# EAGLE design curtain (EAGLE 9.4.0)
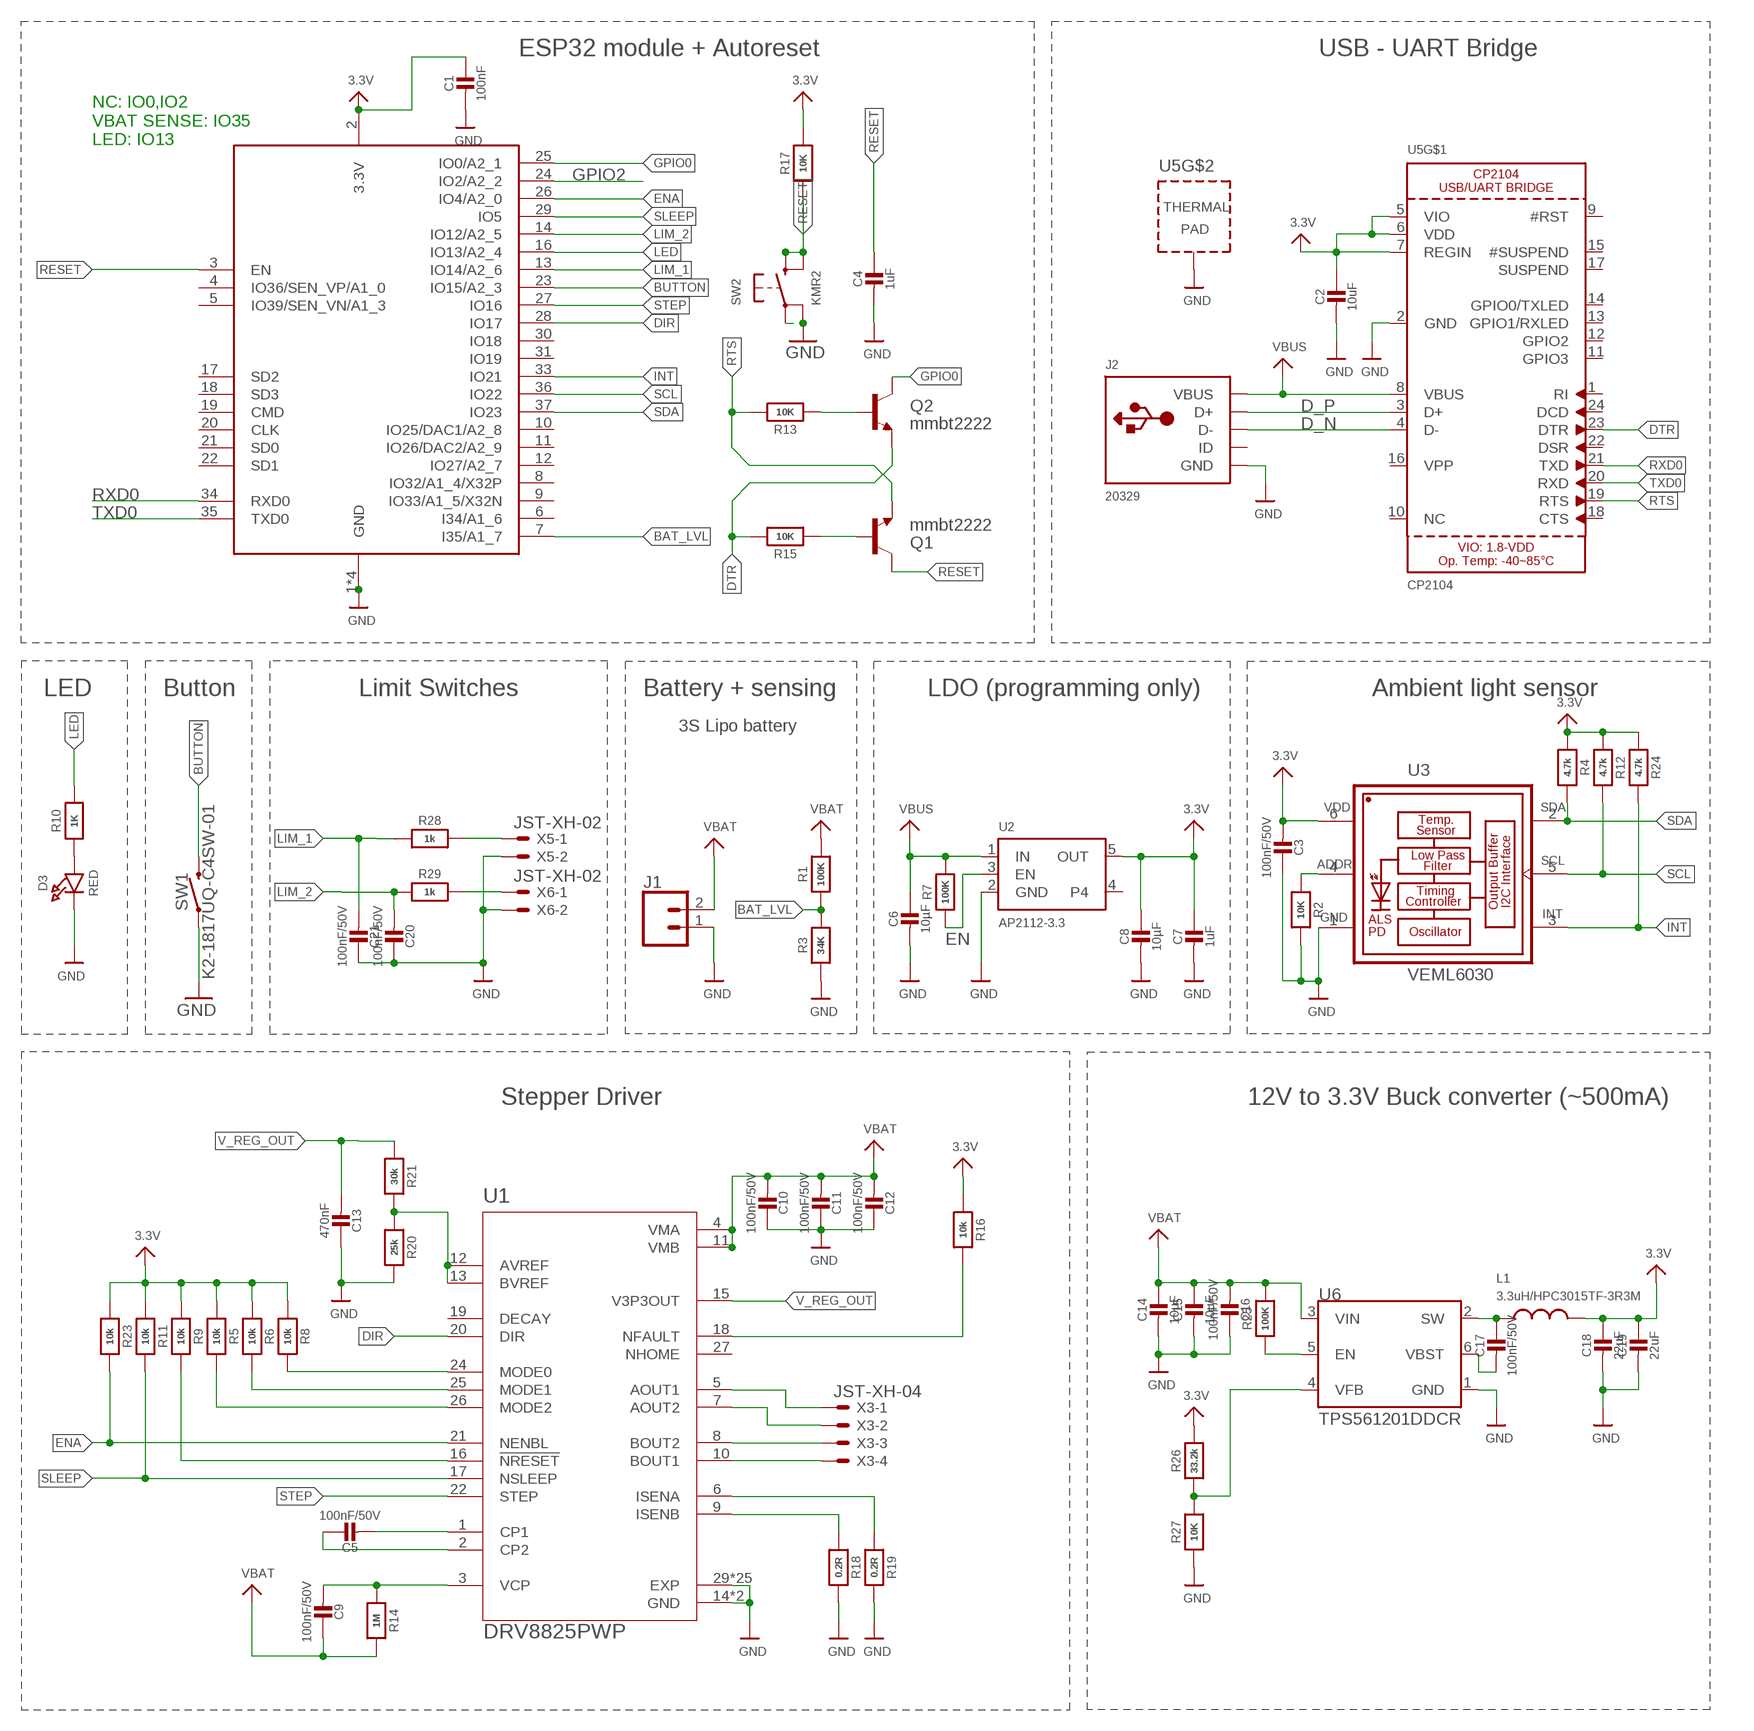
[diagram p0: schematic, sheet 1]

## Parts
C1  100nF  CAP_CERAMIC_0402  [_0402]
C2  10uF  CAP_CERAMIC_0402  [_0402]
C3  100nF/50V  CAP_CERAMIC_0402  [_0402]
C4  1uF  CAP_CERAMIC_0402  [_0402]
C5  100nF/50V  CAP_CERAMIC_0805  [_0805]
C6  10µF  CAP_CERAMIC_0402  [_0402]
C7  1uF  CAP_CERAMIC_0402  [_0402]
C8  10µF  CAP_CERAMIC_0402  [_0402]
C9  100nF/50V  CAP_CERAMIC_0805  [_0805]
C10  100nF/50V  CAP_CERAMIC_0805  [_0805]
C11  100nF/50V  CAP_CERAMIC_0805  [_0805]
C12  100nF/50V  CAP_CERAMIC_0805  [_0805]
C13  470nF  CAP_CERAMIC_0402  [_0402]
C14  10µF  CAP_CERAMIC_0402  [_0402]
C15  10µF  CAP_CERAMIC_0402  [_0402]
C16  100nF/50V  CAP_CERAMIC_0402  [_0402]
C17  100nF/50V  CAP_CERAMIC_0402  [_0402]
C18  22uF  CAP_CERAMIC_0402  [_0402]
C19  22uF  CAP_CERAMIC_0402  [_0402]
C20  100nF/50V  CAP_CERAMIC_0402  [_0402]
C21  100nF/50V  CAP_CERAMIC_0402  [_0402]
D3  RED  LED0805_NOOUTLINE  [CHIPLED_0805_NOOUTLINE]
J1  CONN_023.5MM_LOCK  [SCREWTERMINAL-3.5MM-2_LOCK]
J2  20329  USB_MICRO_20329_V2  [4UCONN_20329_V2]
L1  3.3uH/HPC3015TF-3R3M  WPN4020H100MT  [WPN4020H100MT]
Q1  mmbt2222  TRANSISTOR_NPNSOT23-3  [SOT23-3]
Q2  mmbt2222  TRANSISTOR_NPNSOT23-3  [SOT23-3]
R1  100K  RESISTOR_0402  [_0402]
R2  10K  RESISTOR_0402  [_0402]
R3  34K  RESISTOR_0402  [_0402]
R4  4.7k  RESISTOR_0402  [_0402]
R5  10k  RESISTOR_0402  [_0402]
R6  10k  RESISTOR_0402  [_0402]
R7  100K  RESISTOR_0402  [_0402]
R8  10k  RESISTOR_0402  [_0402]
R9  10k  RESISTOR_0402  [_0402]
R10  1K  RESISTOR_0402  [_0402]
R11  10k  RESISTOR_0402  [_0402]
R12  4.7k  RESISTOR_0402  [_0402]
R13  10K  RESISTOR_0402  [_0402]
R14  1M  RESISTOR_0402  [_0402]
R15  10K  RESISTOR_0402  [_0402]
R16  10k  RESISTOR_0402  [_0402]
R17  10K  RESISTOR_0402  [_0402]
R18  0.2R  RESISTOR_1206  [_1206]
R19  0.2R  RESISTOR_1206  [_1206]
R20  25k  RESISTOR_0402  [_0402]
R21  30k  RESISTOR_0402  [_0402]
R23  10k  RESISTOR_0402  [_0402]
R24  4.7k  RESISTOR_0402  [_0402]
R25  100K  RESISTOR_0402  [_0402]
R26  33.2k  RESISTOR_0402  [_0402]
R27  10K  RESISTOR_0402  [_0402]
R28  1k  RESISTOR_0402  [_0402]
R29  1k  RESISTOR_0402  [_0402]
SW1  K2-1817UQ-C4SW-01  [K2-1817UQ-C4SW-01]
SW2  KMR2  SWITCH_TACT_SMT4.6X2.8  [BTN_KMR2_4.6X2.8]
U1  DRV8825PWP  [SOP65P640X120-29N]
U2  AP2112-3.3  VREG_SOT23-5  [SOT23-5]
U3  VEML6030  [VISHAY_VEML6030_2X2X0.87]
U4  ESP32_WROOM32_SKINNY  [WROOM32_SKINNY]
U5  CP2104  [QFN24_4MM_SMSC]
U6  TPS561201DDCR  [SOT95P280X110-6N]
X3  JST-XH-04  JST-XH-04-PIN-ROUND-PAD  [JST-XH-04-PACKAGE-ROUND-PAD]
X5  JST-XH-02  JST-XH-02-PIN-ROUND-PAD  [JST-XH-02-PACKAGE-ROUND-PAD]
X6  JST-XH-02  JST-XH-02-PIN-ROUND-PAD  [JST-XH-02-PACKAGE-ROUND-PAD]

## Nets
3.3V: C1.1 C2.1 C3.2 C7.1 C8.1 C18.1 C19.1 L1.2 R4.1 R5.1 R6.1 R8.1 R9.1 R11.1 R12.1 R16.1 R17.2 R23.1 R24.1 R26.1 U2.5(OUT) U3.6(VDD) U4.2(3.3V) U5.5(VIO) U5.6(VDD) U5.7(REGIN)
BAT_LVL: R1.1 R3.2 U4.7(I35/A1_7)
BUTTON: SW1.P$2 U4.23(IO15/A2_3)
D_N: J2.D- U5.4(D-)
D_P: J2.D+ U5.3(D+)
DIR: U1.20(DIR) U4.28(IO17)
DTR: Q2.2(E) R15.2 U5.23(DTR)
EN: R7.1 U2.3(EN)
ENA: R23.2 U1.21(NENBL) U4.26(IO4/A2_0)
GND: C1.2 C2.2 C3.1 C4.2 C6.2 C7.2 C8.2 C10.1 C11.1 C12.1 C13.1 C14.2 C15.2 C16.1 C18.2 C19.2 C20.1 C21.1 D3.C J1.1 J2.BASE@1(GND) J2.BASE@2(GND) J2.GND J2.SPRT@1(GND) J2.SPRT@2(GND) J2.SPRT@3(GND) J2.SPRT@4(GND) R2.2 R3.1 R18.2 R19.2 R20.2 R27.1 SW1.P$1 SW2.A'(P1) U1.14(GND) U1.28(GND) U1.29(EXP) U1.P1(EXP) U1.P2(EXP) U1.P3(EXP) U1.P4(EXP) U1.P5(EXP) U1.P6(EXP) U1.P7(EXP) U1.P8(EXP) U1.P9(EXP) U1.P10(EXP) U1.P11(EXP) U1.P12(EXP) U1.P13(EXP) U1.P14(EXP) U1.P15(EXP) U1.P16(EXP) U1.P17(EXP) U1.P18(EXP) U1.P19(EXP) U1.P20(EXP) U1.P21(EXP) U1.P22(EXP) U1.P23(EXP) U1.P24(EXP) U2.2(GND) U3.1(GND) U4.1(GND) U4.15(GND) U4.38(GND) U4.P$1(GND) U5.2(GND) U5.THERM(TP) U6.1(GND) X5.2 X6.2
GPIO0: Q2.3(C) U4.25(IO0/A2_1)
GPIO2: U4.24(IO2/A2_2)
INT: R24.2 U3.3(INT) U4.33(IO21)
LED: R10.1 U4.16(IO13/A2_4)
LIM_1: C21.2 R28.1 U4.13(IO14/A2_6)
LIM_2: C20.2 R29.1 U4.14(IO12/A2_5)
N$1: R2.1 U3.4(ADDR)
N$2: SW2.A(P)
N$3: U1.8(BOUT2) X3.3
N$4: U1.10(BOUT1) X3.4
N$5: D3.A R10.2
N$6: R28.2 X5.1
N$7: R25.1 U6.5(EN)
N$8: Q2.1(B) R13.1
N$9: R8.2 U1.24(MODE0)
N$10: R6.2 U1.25(MODE1)
N$11: R5.2 U1.26(MODE2)
N$12: Q1.1(B) R15.1
N$13: R9.2 U1.16(!NRESET)
N$14: C17.1 L1.1 U6.2(SW)
N$15: C5.2 U1.1(CP1)
N$16: C5.1 U1.2(CP2)
N$17: C9.2 R14.1 U1.3(VCP)
N$18: C17.2 U6.6(VBST)
N$19: R20.1 R21.2 U1.12(AVREF) U1.13(BVREF)
N$20: R16.2 U1.18(NFAULT)
N$21: R29.2 X6.1
N$22: U1.5(AOUT1) X3.1
N$23: U1.7(AOUT2) X3.2
N$24: R26.2 R27.2 U6.4(VFB)
N$27: R19.1 U1.6(ISENA)
N$28: R18.1 U1.9(ISENB)
RESET: C4.1 Q1.3(C) R17.1 SW2.B'(S1) SW2.B(S) U4.3(EN)
RTS: Q1.2(E) R13.2 U5.19(RTS)
RXD0: U4.34(RXD0) U5.21(TXD)
SCL: R12.2 U3.5(SCL) U4.36(IO22)
SDA: R4.2 U3.2(SDA) U4.37(IO23)
SLEEP: R11.2 U1.17(NSLEEP) U4.29(IO5)
STEP: U1.22(STEP) U4.27(IO16)
TXD0: U4.35(TXD0) U5.20(RXD)
V_REG_OUT: C13.2 R21.1 U1.15(V3P3OUT)
VBAT: C9.1 C10.2 C11.2 C12.2 C14.1 C15.1 C16.2 J1.2 R1.2 R14.2 R25.2 U1.4(VMA) U1.11(VMB) U6.3(VIN)
VBUS: C6.1 J2.VBUS R7.2 U2.1(IN) U5.8(VBUS)
Unconnected: J2.ID U1.19(DECAY) U1.27(NHOME) U2.4 U4.4(IO36/SEN_VP/A1_0) U4.5(IO39/SEN_VN/A1_3) U4.6(I34/A1_6) U4.8(IO32/A1_4/X32P) U4.9(IO33/A1_5/X32N) U4.10(IO25/DAC1/A2_8) U4.11(IO26/DAC2/A2_9) U4.12(IO27/A2_7) U4.17(SD2) U4.18(SD3) U4.19(CMD) U4.20(CLK) U4.21(SD0) U4.22(SD1) U4.30(IO18) U4.31(IO19) U5.1(RI) U5.9(#RST) U5.10(NC) U5.11(GPIO3) U5.12(GPIO2) U5.13(GPIO1/RXLED) U5.14(GPIO0/TXLED) U5.15(#SUSPEND) U5.16(VPP) U5.17(SUSPEND) U5.18(CTS) U5.22(DSR) U5.24(DCD)

## Notes on the sheet
- ESP32 module + Autoreset | USB - UART Bridge
- NC: IO0,IO2
  VBAT SENSE: IO35
  LED: IO13
- Button
- LED | Limit Switches | Battery + sensing | LDO (programming only) | Ambient light sensor
- 3S Lipo battery
- Stepper Driver | 12V to 3.3V Buck converter (~500mA)

## Library data of the parts
C1-C21 = microbuilder:CAP_CERAMIC: Ceramic Capacitors For new designs, use the packages preceded by an '_' character since they are more reliable: The following footprints should be used on most boards: _0402 - Standard footprint for regular board layouts _0603 - Standard footprint for regular board layouts _0805 - Standard footprint for regular board layouts _1206 - Standard footprint for regular board layouts For extremely tight-pitch boards where space is at a premium, the following 'micro-pitch' footprints can be used (smaller pads, no silkscreen outline, etc.): _0402MP - Micro-pitch footprint for very dense/compact boards _0603MP - Micro-pitch footprint for very dense/compact boards _0805MP - Micro-pitch footprint for very dense/compact boards _1206MP - Micro-pitch footprint for very dense/compact boards
D3 = microbuilder:LED: LED 0603 - 0603 Surface Mount Package 2mA: Green LED - Low Power (3.9mcd, 2ma, 1.7Vf) - Digikey: 475-2709-2-ND Orange LED - Low Power (9.8mcd, 2ma, 1.8Vf) - Digikey: 475-1194-2-ND Red LED - Low Power (5mcd, 2ma, 1.8Vf) - Digikey: 475-1195-2-ND Yellow LED - Low Power (7mcd, 2ma, 1.8Vf) - Digikey: 475-1196-2-ND 5mA: Blue LED - Low Power (17mcd, 5ma, 2.9Vf) - Digikey: LNJ937W8CRACT-ND 0805 - 0805 Surface Mount Package 2mA: Red LED (8.8mcd, 2mA, 1.8Vf, Clear) - Low Power [Digikey: 475-2510-1-ND] Green LED (5mcd, 2mA, 1.8Vf, Clear) - Low Power [Digikey: 475-2730-1-ND] Yellow LED (11.3mcd, 2mA, 1.8Vf, Clear) - Low Power [Digikey: 475-2555-1-ND] 20mA: Red LED (104mcd, 20mA, Diffused) - LS R976 [Digikey: 475-1278-6-ND] Red LED (12mcd, 20mA, 2.0Vf, Clear) - APT2012EC [Digikey: 754-1128-1-ND] Green LED (15mcd, 20mA, 2.2Vf, Clear) - APT2012GC [Digikey: 754-1131-1-ND] Orange LED (160mcd, 20mA, 2.1Vf, Clear) - APT2012SECK [Digikey: 754-1130-1-ND] 1206 - 1206 Surface Mount Package Green LED (26mcd, 20mA, Diffused) - LG N971 [Digikey: 475-1407-6-ND] Red LED (15mcd, 20mA, Diffused) - LH N974 [Digikey: 475-1416-6-ND] Cree - Cree High-Power Surface Mount LEDs XPEBWT-L1-0000-00D50 - White 111lm 350mA 2.9Vf 6200K 110° XTEAWT-00-0000-00000LEE3 - White 114lm 350mA 2.85Vf 5000K 115° Everlight - Everlight 45-21 Series Surface Mount LEDs 45-21/QK2C-B2832AC2CB2/2T - Warm White 2000mcd 20mA 3.25Vf 3050K 120° 45-21/LK2C-B38452C4CB2/2T - Nuetral White 2000mcd 20mA 3.25Vf 4150K 120° 45-21/LK2C-B50634C6CB2/2T - Cold White 2200mcd 20mA 3.25Vf 5650K 120° PLCC2 Reverse Mount LS T77K-J1L2-1-0-2-R18-Z - Red 11.25mcd 2mA 1.8Vf 630nm 120° LO T77K-L1M2-24-Z - Orange 19.6mcd 2mA 1.8Vf 606nm 120° LY T77K-K2M1-26-Z - Yellow 15.7mcd 2mA 1.8Vf 587nm 120°
J1 = SparkFun-Connectors:CONN_02: Multi connection point. Often used as Generic Header-pin footprint for 0.1 inch spaced/style header connections On any of the 0.1 inch spaced packages, you can populate with these: Break Away Headers - Straight <https://www.sparkfun.com/products/116> (PRT-00116) Break Away Male Headers - Right Angle <https://www.sparkfun.com/products/553> (PRT-00553) Female Headers <https://www.sparkfun.com/products/115> (PRT-00115) Break Away Headers - Machine Pin <https://www.sparkfun.com/products/117> (PRT-00117) Break Away Female Headers - Swiss Machine Pin <https://www.sparkfun.com/products/743> (PRT-00743) For SCREWTERMINALS and SPRING TERMINALS visit here: Screw Terimnals on SparkFun.com <https://www.sparkfun.com/search/results?term=Screw+Terminals> (5mm/3.5mm/2.54mm spacing) This device is also useful as a general connection point to wire up your design to another part of your project. Our various solder wires solder well into these plated through hole pads. Hook-Up Wire - Assortment (Stranded, 22 AWG) <https://www.sparkfun.com/products/11375> (PRT-11375) Hook-Up Wire - Assortment (Solid Core, 22 AWG) <https://www.sparkfun.com/products/11367> (PRT-11367) View the entire wire category on our website here <https://www.sparkfun.com/categories/141> Special notes: Molex polarized connector foot print use with: PRT-08233 with associated crimp pins and housings. 2.54_SCREWTERM for use with PRT-10571. 3.5mm Screw Terminal footprints for PRT-08084 5mm Screw Terminal footprints for use with PRT-08432; PROD_ID: CONN-08399
J2 = microbuilder:USB: USB Connectors USBMINIB - Surface Mount Female Mini-B USB Connector 4UConnector: 06564
L1 = LMR62421XSD_NOPB:WPN4020H100MT
Q1 Q2 = SparkFun:TRANSISTOR_NPN: Transistor NPN BJT configuration in SOT23 package. MMBT2222 is the common NPN we use. Double check BCE configuration again layout.
R1-R21 R23-R29 = microbuilder:RESISTOR: Resistors For new designs, use the packages preceded by an '_' character since they are more reliable: The following footprints should be used on most boards: _0402 - Standard footprint for regular board layouts _0603 - Standard footprint for regular board layouts _0805 - Standard footprint for regular board layouts _1206 - Standard footprint for regular board layouts For extremely tight-pitch boards where space is at a premium, the following 'micro-pitch' footprints can be used (smaller pads, no silkscreen outline, etc.): _0402MP - Micro-pitch footprint for very dense/compact boards _0603MP - Micro-pitch footprint for very dense/compact boards _0805MP - Micro-pitch footprint for very dense/compact boards _1206MP - Micro-pitch footprint for very dense/compact boards
SW1 = Adafruit ESP8266 Feather rev E:K2-1817UQ-C4SW-01
SW2 = microbuilder:SWITCH_TACT_SMT: SMT Tact Switches 6x6mm - Digikey: P12940SCT-ND KMR2 (4.6x2.8mm) - Digikey: 401-1426-1-ND EVQ-PQHB55 - Light Touch, 160GF (4.5x4.5mm) - Digikey: P8090SCT-ND KMT0 - KMT021 NGJ LHS (etc.) IP68/Waterproof - Digikey: CKN10289CT-ND
U1 = DRV8825PWP:DRV8825PWP: 2.5A Bipolar Stepper Motor Driver with On-Chip 1/32 Microstepping Indexer (Step/Dir Ctrl) 28-HTSSOP -40 to 85; AVAILABILITY: Unavailable; DESCRIPTION: Bipolar Motor Driver Power MOSFET Logic 28-HTSSOP; MF: Texas Instruments; MP: DRV8825PWP; PACKAGE: HTSSOP-28 Texas Instruments; PRICE: None
U2 = microbuilder:VREG_SOT23-5: SOT23-5 Fixed Voltage Regulators Part Current Out V Out V In V Dropout θJA (°C/W) TJ (°C) Digikey Part No. ADP121 150mA 3.3V 3.4-5.5V 0.09V @ 150mA -- -- ADP121-AUJZ33R7CT-ND ADP121 150mA 3.0V 3.1-5.5V 0.09V @ 150mA -- -- ADP121-AUJZ30R7CT-ND ADP122 300mA 3.3V 3.4-5.5V 0.085V @ 300mA -- -- ADP122AUJZ-3.3-R7CT-ND ADP1712 300mA 3.3V 3.5-5.5V 0.17V @ 300mA -- -- ADP1712AUJZ-3.3-R7TR-ND AP7311 (Low Cost) 150mA 3.3V 3.5-6V 0.15V @ 150mA -- -- AP7311-33WG-7DICT-ND LD39015M18R 150mA 1.8V 1.9V-5.5V 0.08V @ 100mA -- -- 497-6977-1-ND LP2985A-33DBVR 150mA 3.3V 3.3-16V 0.28V @ 150mA 206 150 296-18479-1-ND MCP1824T-3302E/OT 300mA 3.3V 3.5V-6V 0.2V @ 300mA -- -- MCP1824T-3302E/OTCT-ND MIC5205-2.5YM5 TR 150mA 2.5V 2.7-16V 0.165V @ 150mA -- -- 576-1257-2-ND MIC5205-3.0YM5 TR 150mA 3.0V 3.2V-16V 0.165V @ 150mA -- -- 576-1258-2-ND MIC5205-3.3YM5 TR 150mA 3.3V 3.5V-16V 0.165V @ 150mA -- -- 576-1259-2-ND TPS780330220 150mA 3.3V+2.2V 3.6-5.5V 250mV Max -- -- 296-23332-1-ND TDA3663/N1,135 100mA 3.3V 3.5-45V 0.18V @ 50mA -- -- 568-5343-1-ND Max operating temp can be calculated using θJA, TJ (max junction temperature), and power in watts. Set the "Maximum Ambient Temperature" until it reaches TJ ("Max Junction Temperature"), which is the absolute limit for safe use of the regulator: Heat Sink Temperature Calculator <http://www.daycounter.com/Calculators/Heat-Sink-Temperature-Calculator.phtml> For example, With 12V source into a 3.3V LP2985 and a 30mA load, we are dissipating (12V-3.3V) * 0.03A = 0.261W. With a θJA of 206 °C/W, a TJ of 150°C, and 261mW we can safely use the chip without a heat sink up to 75°C (=147.1°C Junction Temperature).
U3 = VEML6030:VEML6030: VEML6030 High Accuracy Ambient Light Sensor with I2C Interface: VEML6030 is a high accuracy ambient light digital 16-bit resolution sensor in a miniature transparent 2 mm x 2 mm package. It includes a high sensitive photodiode, a low noise amplifier, a 16-bit A/D converter and supports an easy to use I2C bus communication interface and additional interrupt feature. The ambient light result is as digital value available. Device Model created 15.06.2016 by Johannes Kolb - Vishay Semiconductor GmbH; AVAILABILITY: Unavailable; DESCRIPTION: Optical Sensor Ambient 550nm I²C 6-SMD, No Lead; MF: Vishay; MP: VEML6030; PACKAGE: SMD-6 Vishay; PRICE: None
U4 = microbuilder:ESP32_WROOM32
U5 = microbuilder:CP2104: CP2104 - USB to UART Bridge VDD Output: 3.45V
U6 = TPS561201DDCR:TPS561201DDCR: Voltage RegulatorThe TPS561201 and TPS561208 are simple, easy-to-use, 1-A synchronous step-down converters in SOT23 package.; AVAILABILITY: Unavailable; DESCRIPTION: Buck Switching Regulator IC Positive Adjustable 0.76V 1 Output 1A SOT-23-6 Thin, TSOT-23-6; MF: Texas Instruments; MP: TPS561201DDCR; PACKAGE: SOT-23 Texas Instruments; PRICE: None
X3 = con-jst-xh:JST-XH-04-PIN: JST XH Connector 2 Pin Wire to board connector. Pitch: 2,54 mm, (0.100") Number of pins: 4 Created by Rembrandt Electronics www.rembrandtelectronics.com
X5 X6 = con-jst-xh:JST-XH-02-PIN: JST XH Connector 2 Pin Wire to board connector. Pitch: 2,54 mm, (0.100") Number of pins: 2 Created by Rembrandt Electronics www.rembrandtelectronics.com

## Board
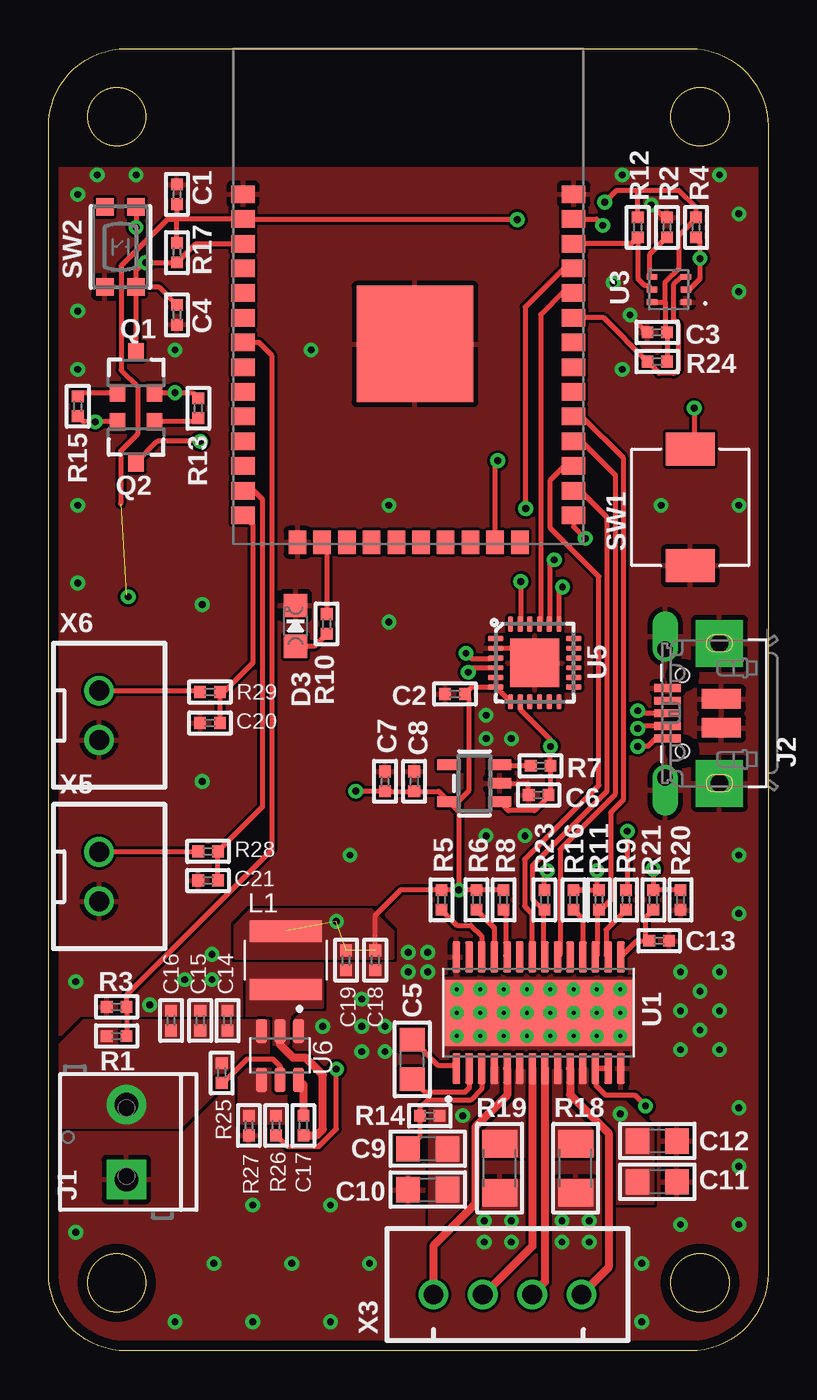
[diagram p1: board, top side]
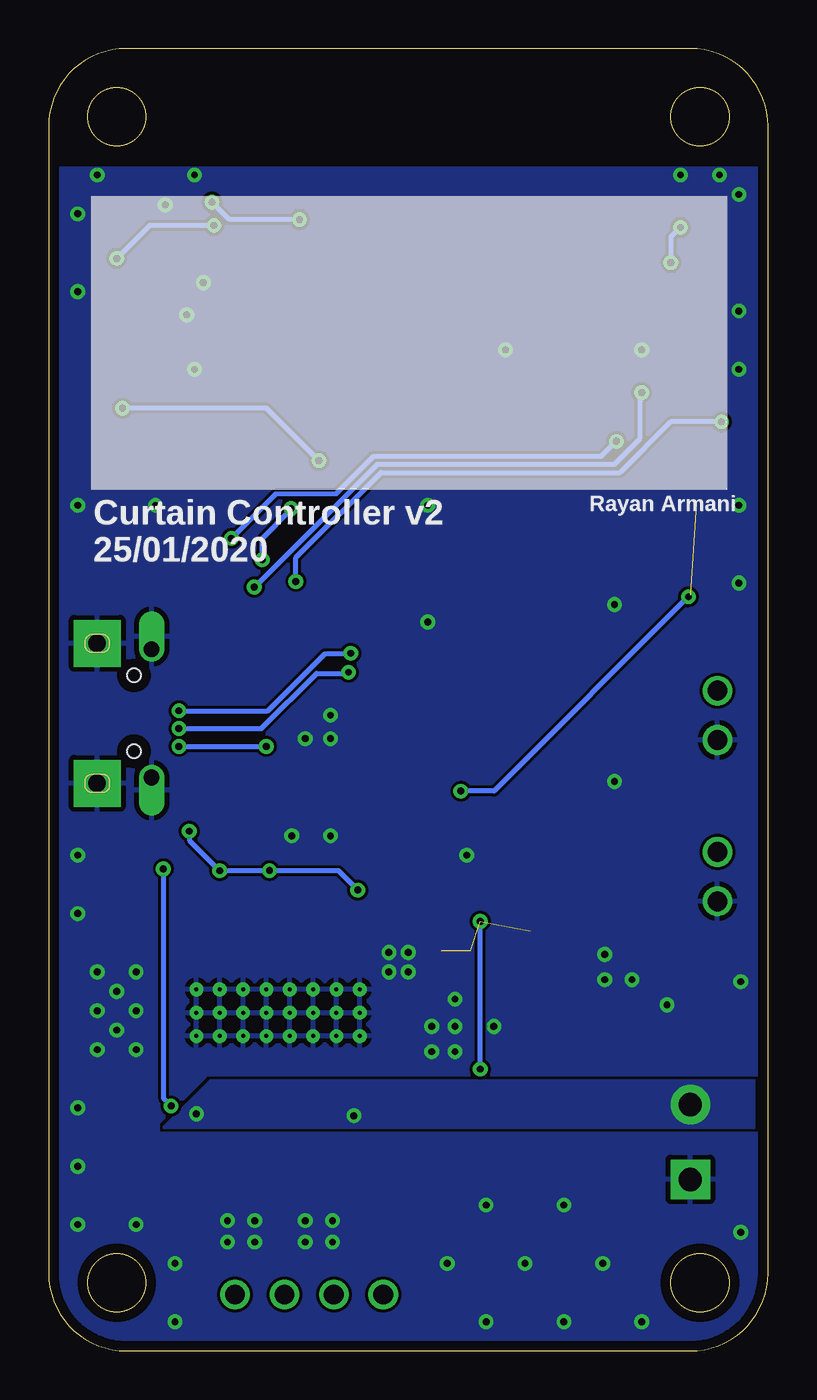
[diagram p2: board, bottom side, seen from below]

Size 37 x 67 mm. Coordinates in mm from the lower left corner, seen from the top.
Outline: 33,67 arc-90 37,63 37,4 arc-90 33,0 4,0 arc-90 0,4 0,63 arc-90 4,67 33,67
Outline: circle at 3.5,63.5 radius 1.5
Outline: circle at 33.5,3.5 radius 1.5
Outline: circle at 3.5,3.5 radius 1.5
Outline: circle at 33.5,63.5 radius 1.5
Outline: circle at 3.5,63.5 radius 1.5
Copper layers (1*16): Top 0.035mm / dielectric 1.5mm / Bottom 0.035mm
Design rules "default": minimum track width 6mil, minimum drill 0.35mm, track to track 6mil, track to pad 6mil, pad to pad 6mil, via to via 6mil, smd to smd 6mil, copper to edge 20mil, drill to drill 6mil, minimum pad ring 10mil, minimum via ring 8mil, stop-mask expansion 4mil, vias tented up to drill 0.4mm, thermal gap 10mil

### Footprints (pad centres in the part's own frame; a part is rotated, then mirrored left to right if it is on the bottom)
_0402 = smd 0.6 x 0.6: 1 -0.508,0; 2 0.508,0
_0805 = smd 1.2 x 1.3: 1 -1.016,0; 2 1.016,0
CHIPLED_0805_NOOUTLINE = smd 1.2 x 1.2: A 0,-1.05; C 0,1.05
SCREWTERMINAL-3.5MM-2_LOCK = drill 1.2 pad 2.032 square: 1 -0.178,0 | drill 1.2 pad 2.032: 2 3.678,0
4UCONN_20329_V2 = smd 1 x 2: BASE@1 -0.75,-2; BASE@2 0.75,-2 | smd 0.4 x 1.35: D+ 0,0.775; D- -0.65,0.775; GND 1.3,0.775; ID 0.65,0.775; VBUS -1.3,0.775 | drill 0.8 pad 1.143 offset: SPRT@1 -3.3,0.9; SPRT@2 3.3,0.9 | drill 0.9 pad 2.413 square: SPRT@3 -3.6,-1.9; SPRT@4 3.6,-1.9 | hole 0.7: -1.95,0; 1.95,0
WPN4020H100MT = smd 1.1 x 3.7: 1 -1.5,0; 2 1.5,0
SOT23-3 = smd 0.8 x 0.9: 1 -0.95,-1; 2 0.95,-1; 3 0,1.1
_1206 = smd 1.4 x 1.8: 1 -1.27,0; 2 1.27,0
K2-1817UQ-C4SW-01 = smd 1.7 x 2.5: P$1 -3,0; P$2 3,0
BTN_KMR2_4.6X2.8 = smd 0.9 x 0.9: A 2.05,0.8; A' -2.05,0.8; B 2.05,-0.8; B' -2.05,-0.8
SOP65P640X120-29N = smd 1.57 x 0.41: 1 -2.87,4.225; 2 -2.87,3.575; 3 -2.87,2.925; 4 -2.87,2.275; 5 -2.87,1.625; 6 -2.87,0.975; 7 -2.87,0.325; 8 -2.87,-0.325; 9 -2.87,-0.975; 10 -2.87,-1.625; 11 -2.87,-2.275; 12 -2.87,-2.925; 13 -2.87,-3.575; 14 -2.87,-4.225; 15 2.87,-4.225; 16 2.87,-3.575; 17 2.87,-2.925; 18 2.87,-2.275; 19 2.87,-1.625; 20 2.87,-0.975; 21 2.87,-0.325; 22 2.87,0.325; 23 2.87,0.975; 24 2.87,1.625; 25 2.87,2.275; 26 2.87,2.925; 27 2.87,3.575; 28 2.87,4.225 | smd 3.4 x 9.7: 29 0,0 | drill 0.2 pad 0.3: P1 -1.2,0.6; P2 0,0.6; P3 1.2,0.6; P4 -1.2,-0.6; P5 0,-0.6; P6 1.2,-0.6; P7 -1.2,-1.8; P8 0,-1.8; P9 1.2,-1.8; P10 -1.2,-3; P11 0,-3; P12 1.2,-3; P13 -1.2,-4.2; P14 0,-4.2; P15 1.2,-4.2; P16 -1.2,1.8; P17 0,1.8; P18 1.2,1.8; P19 -1.2,3; P20 0,3; P21 1.2,3; P22 -1.2,4.2; P23 0,4.2; P24 1.2,4.2
SOT23-5 = smd 0.55 x 1.2: 1 -0.95,-1.3; 2 0,-1.3; 3 0.95,-1.3; 4 0.95,1.3; 5 -0.95,1.3
VISHAY_VEML6030_2X2X0.87 = smd 0.55 x 0.3: 1 -0.875,0.65; 2 -0.875,0; 3 -0.875,-0.65; 4 0.875,-0.65; 5 0.875,0; 6 0.875,0.65
WROOM32_SKINNY = smd 1.2 x 0.9: 1 -8.5,5; 2 -8.5,3.73; 3 -8.5,2.46; 4 -8.5,1.19; 5 -8.5,-0.08; 6 -8.5,-1.35; 7 -8.5,-2.62; 8 -8.5,-3.89; 9 -8.5,-5.16; 10 -8.5,-6.43; 11 -8.5,-7.7; 12 -8.5,-8.97; 13 -8.5,-10.24; 14 -8.5,-11.51; 25 8.5,-11.51; 26 8.5,-10.24; 27 8.5,-8.97; 28 8.5,-7.7; 29 8.5,-6.43; 30 8.5,-5.16; 31 8.5,-3.89; 32 8.5,-2.62; 33 8.5,-1.35; 34 8.5,-0.08; 35 8.5,1.19; 36 8.5,2.46; 37 8.5,3.73; 38 8.5,5 | smd 0.9 x 1.2: 15 -5.7,-12.9; 16 -4.43,-12.9; 17 -3.16,-12.9; 18 -1.89,-12.9; 19 -0.62,-12.9; 20 0.65,-12.9; 21 1.92,-12.9; 22 3.19,-12.9; 23 4.46,-12.9; 24 5.73,-12.9 | smd 6 x 6: P$1 0.34,-2.7
QFN24_4MM_SMSC = smd 0.8 x 0.28: 1 -2,1.25; 2 -2,0.75; 3 -2,0.25; 4 -2,-0.25; 5 -2,-0.75; 6 -2,-1.25; 13 2,-1.25; 14 2,-0.75; 15 2,-0.25; 16 2,0.25; 17 2,0.75; 18 2,1.25 | smd 0.28 x 0.8: 7 -1.25,-2; 8 -0.75,-2; 9 -0.25,-2; 10 0.25,-2; 11 0.75,-2; 12 1.25,-2; 19 1.25,2; 20 0.75,2; 21 0.25,2; 22 -0.25,2; 23 -0.75,2; 24 -1.25,2 | smd 2.5 x 2.5: THERM 0,0
SOT95P280X110-6N = smd 1.25 x 0.59: 1 -1.255,0.95; 2 -1.255,0; 3 -1.255,-0.95; 4 1.255,-0.95; 5 1.255,0; 6 1.255,0.95
JST-XH-04-PACKAGE-ROUND-PAD = drill 1.016: 1 -3.81,0; 2 -1.27,0; 3 1.27,0; 4 3.81,0
JST-XH-02-PACKAGE-ROUND-PAD = drill 1.016: 1 -1.27,0; 2 1.27,0

### Placement (x,y rotation side)
C1  6.6,59.5 90 top
C2  20.9,33.8 180 top
C3  31.3,52.4 0 top
C4  6.6,53.3 270 top
C5  18.7,15 90 top
C6  25.2,28.6 180 top
C7  17.3,29.3 90 top
C8  18.8,29.3 90 top
C9  19.5,10.4 180 top
C10  19.5,8.3 0 top
C11  31.3,8.7 180 top
C12  31.3,10.8 180 top
C13  31.4,21.1 180 top
C14  9.2,17 90 top
C15  7.8,17 90 top
C16  6.3,17 270 top
C17  13.1,11.6 90 top
C18  16.8,20.1 270 top
C19  15.3,20.1 270 top
C20  8.3,32.3 0 top
C21  8.2,24.2 0 top
D3  12.7,37.3 0 top
J1  4,9 90 top
J2  32.6,32.8 90 top
L1  12.2,20.1 90 top
Q1  4.5,50.3 0 top
Q2  4.5,46.8 180 top
R1  3.5,16.2 180 top
R2  31.8,57.8 90 top
R3  3.5,17.7 0 top
R4  33.3,57.8 270 top
R5  20.2,23.2 270 top
R6  22,23.2 270 top
R7  25.3,30.1 0 top
R8  23.4,23.2 270 top
R9  29.7,23.2 270 top
R10  14.3,37.4 270 top
R11  28.3,23.2 270 top
R12  30.3,57.8 270 top
R13  7.7,48.5 90 top
R14  19.6,12.1 0 top
R15  1.5,48.6 270 top
R16  27,23.2 270 top
R17  6.6,56.5 90 top
R18  27.1,9.4 270 top
R19  23.2,9.4 270 top
R20  32.5,23.2 270 top
R21  31.1,23.2 90 top
R23  25.5,23.2 270 top
R24  31.3,50.9 180 top
R25  8.9,14.3 90 top
R26  11.7,11.6 90 top
R27  10.3,11.6 90 top
R28  8.2,25.7 180 top
R29  8.3,33.9 180 top
SW1  33,43.4 90 top
SW2  3.7,56.8 90 top
U1  25.2,17.4 90 top
U2  21.9,29.2 90 top
U3  31.9,54.6 180 top
U4  18.5,54.5 0 top
U5  25,35.4 0 top
U6  11.9,15.2 270 top
X3  23.6,2.9 0 top
X5  2.6,24.4 270 top
X6  2.6,32.7 270 top

### Tracks (layer width: path | path; a pad name or v marks a point on that pad's centre or on a via)
3.3V  (via drill 0.35)  (4 unrouted)
  Top 0.254: 3.7,43.59 3.7,46.3 4.6,47.2 4.6,49.6 3.73,50.47 3.73,55.83 6.1,58.2 6.6,58.2 | C1.1 6.6,58.2 | R17.2 6.6,58.2 | 6.6,58.2 6.63,58.23 U4.2 24.07,58.23 v24.1,58.2 | U5.5 U5.6 | U5.6 21.76,34.15 C2.1 21.6,33.61 21.6,28.8 21.05,28.25 U2.5 | U5.6 U5.7 | v28.2,24.71 28.2,23.81 R11.1 R16.1 27.7,23.71 | v29.77,26.73 29.77,23.77 R9.1 | R8.1 R6.1 v21.1,23.71 | v21.1,23.71 R5.1 18.1,23.71 16.8,22.41 C18.1 | C7.1 17.6,28.79 | 17.6,28.79 C8.1 20.06,28.79 U2.5 | U2.5 21.1,27.75 v21.1,23.71 | R26.1 12.28,10.51 13.89,10.51 14.8,11.42 v14.8,14.5 | R12.1 30.3,59.4 30.3,59.6 30.3,59.7 | 31.72,53.95 31.72,55.02 32.42,55.72 32.42,57.41 33.3,58.29 R4.1 33.3,58.81 32.41,59.7 30.3,59.7 | U3.6 31.72,53.95 | 31.72,53.95 31.72,52.49 C3.2 R24.1 | 30.3,59.7 29.2,59.7 v28.6,59.1 | 3.99,38.9 v4.09,38.8 | v15.8,28.8 17.59,28.8 17.6,28.79 | R23.1 25.5,24.57 v25.64,24.71
  Bottom 0.254: v29.77,26.73 29.77,26.27 v28.2,24.7 v28.2,24.71 25.7,24.71 | 25.7,24.71 22.1,24.71 v21.1,23.71 | v14.8,14.5 v14.8,22.1 | v24.1,58.2 27.7,58.2 v28.6,59.1 | v4.09,38.8 14.09,28.8 v15.8,28.8 | v25.64,24.71 25.7,24.71
  pour Top (no thermals): 10.4,22.7 16.6,22.7 17.7,21.6 17.7,20.2 9.6,20.2 9.6,21.9
BAT_LVL
  Top 0.254: R1.1 R3.2 4.01,18.31 11.5,25.8 11.5,51.2 10.82,51.88 U4.7
BUTTON  (via drill 0.35)
  Top 0.254: U4.23 22.96,45.66 v23.1,45.8 | v33.2,48.5 33.2,46.6 SW1.P$2
  Bottom 0.254: v23.1,45.8 25.8,48.5 v33.2,48.5
D_N  (via drill 0.35)
  Top 0.254: v30.3,32.02 30.43,32.15 J2.D- | v21.58,34.91 21.82,35.15 U5.4
  Bottom 0.254: v30.3,32.02 26.05,32.02 23.21,34.86 21.63,34.86 v21.58,34.91
D_P  (via drill 0.35)
  Top 0.254: v30.3,32.93 30.43,32.8 J2.D+ | v21.46,35.89 21.73,35.63 22.8,35.63 22.98,35.63 U5.3
  Bottom 0.254: v30.3,32.93 25.72,32.93 22.78,35.87 21.46,35.87 v21.46,35.89
DIR
  Top 0.254: U4.28 27.4,46.8 29.14,45.06 29.14,28.64 26.3,25.8 26.3,20.39 U1.20
DTR  (via drill 0.35)
  Top 0.254: R15.2 1.79,47.8 v2.4,47.8 Q2.2 | U5.23 24.29,37.44 24.29,38.28 v24.29,39.59
  Bottom 0.254: v2.4,47.8 5,47.8 7.61,45.19 19.89,45.19 24.29,40.8 v24.29,39.59
EN
  Top 0.254: R7.1 23.25,30.1 U2.3
ENA
  Top 0.254: U4.26 27.34,44.26 28.7,42.9 28.7,28.77 24.88,24.96 24.88,23.24 25.46,22.66 | 25.46,22.66 25.46,20.34 U1.21 | R23.2 25.46,22.66
GND  (via drill 0.35)
  Top 0.254: R2.2 31.65,58.31 v31,58.96 | C3.1 v29.9,53.29 v29.9,53.3 | U5.2 24.25,36.15 U5.THERM | U2.2 24.65,29.2 24.65,28.65 C6.2
  other vias: 22.4,6.7 23.8,6.7 23.8,5.6 22.4,5.6 26.4,6.7 27.8,6.7 27.8,5.6 26.4,5.6 8.4,20.4 5.2,17.8 7,19.1 8.4,19.1 14.1,16.7 16.1,16.7 16.1,18.1 16.1,15.4 17.3,15.4 17.3,16.7 1.4,19 1.4,6.1 10.5,1.5 6.5,1.5 14.5,1.5 12.5,4.5 8.5,4.5 16.5,4.5 14.5,7.5 10.5,7.5 18.5,19.5 19.5,19.5 18.5,20.5 19.5,20.5 32.5,19.5 32.5,17.5 32.5,15.5 33.5,16.5 34.5,15.5 33.5,18.5 34.5,19.5 34.5,17.5 30.5,1.5 30.5,4.5 35.5,6.5 32.5,6.5 35.5,9.5 35.5,12.5 35.5,22.5 35.5,25.5 24.5,26.5 22.5,26.5 22.5,31.5 22.5,32.7 23.8,31.5 35.5,43.5 31.5,43.5 29.5,50.5 29.04,54.96 35.5,54.5 35.5,58.5 29.5,60.5 34.5,60.5 4.5,60.5 2.5,60.5 1.5,59.5 1.5,53.5 1.5,50.5 1.5,43.5 1.5,39.5 7.9,38.4 7.9,29.3 15.5,25.5 17.5,37.5 13.5,51.5 17.5,43.5 6.5,51.5
  pour Top (no thermals): 26,8.8 26,4.9 28.4,4.9 28.4,8.8
  pour Top (no thermals): 22.3,8.8 24.5,8.8 24.5,5.5 24.2,5.2 21.9,5.2 21.9,8.4
  pour Top (rank 3, no thermals): 4.4,20.1 4.4,17.2 6.5,15.1 17.7,15.1 17.7,20.1
  pour Top (rank 4): -2.3,60.8 39.7,60.8 39.7,-5.2 -2.3,-5.2
  pour Bottom (rank 4): -4.5,60.8 40.1,60.8 40.1,-0.7 -4.5,-0.7
  pour Top (rank 3, no thermals): 18.5,19.2 32.5,19.2 32.5,15.5 18.5,15.5
GPIO0  (via drill 0.35)
  Top 0.254: Q2.3 5.6,46.8 v7.8,46.8 | v27.6,41.8 27,42.4 U4.25
  Bottom 0.254: v27.6,41.8 25.3,44.1 22.2,44.1 20.27,46.03 8.57,46.03 v7.8,46.8
INT
  Top 0.254: U4.33 28.54,53.15 R24.2 31.39,50.3 32.13,50.3 32.15,50.32 32.22,50.32 32.39,50.48 32.39,52.82 32.13,53.08 32.13,54.85 32.53,55.25 U3.3
LED
  Top 0.254: U4.16 14.3,41.37 R10.1
LIM_1
  Top 0.254: C21.2 R28.1 11.01,28 11.01,43.8 10.55,44.26 U4.13
LIM_2
  Top 0.254: U4.14 10.5,42.49 10.5,35.39 8.81,33.7 | R29.1 8.81,33.7 | 8.81,33.7 C20.2
N$1
  Top 0.254: R2.1 30.9,56.39 30.9,55.38 U3.4
N$3
  Top 0.406: U1.8 25.52,3.55 X3.3
N$4
  Top 0.406: X3.4 28.8,4.29 28.8,11.2 26.82,13.18 U1.10
N$5
  Top 0.254: R10.2 13.66,36.25 D3.A
N$6
  Top 0.254: R28.2 7.66,25.67 X5.1
N$7
  Top 0.254: R25.1 8.99,13.79 10.2,15 11.54,15 11.9,14.64 U6.5
N$8
  Top 0.254: R13.1 7.51,47.8 Q2.1
N$9
  Top 0.254: R8.2 23.5,22.59 23.5,20.34 U1.24
N$10
  Top 0.254: R6.2 22.93,21.77 U1.25
N$11
  Top 0.254: R5.2 20.99,21.9 21.72,21.9 22.27,21.34 U1.26
N$12
  Top 0.254: R15.1 1.69,49.3 Q1.1
N$13
  Top 0.254: U1.16 28.68,20.37 28.68,21.67 R9.2
N$14
  Top 0.406: C17.1 13.79,11.09 14.1,11.4 14.1,14.2 13.2,15.1 12.57,15.1 11.9,15.77 U6.2
  pour Top (rank 2, no thermals): 10.2,19.9 10.2,16.5 10.9,15.8 12.3,15.8 12.4,15.9 12.4,17.2 12.9,17.7 14.1,17.7 14.1,19.9
N$15
  Top 0.254: C5.2 20.02,14.7 20.8,14.7 U1.1
N$16
  Top 0.254: U1.2 21.62,13.52 21.41,13.31 19.38,13.31 C5.1
N$17
  Top 0.254: U1.3 22.27,13.48 21.7,12.9 19.5,12.9 19.09,12.49 R14.1 19.09,11.01 C9.2
N$18
  Top 0.406: U6.6 13.1,13.7 C17.2
N$19  (via drill 0.35)
  Top 0.254: U1.12 U1.13 28.14,14.53 28.14,13.66 28.63,13.17 30.14,13.17 v30.7,12.61 v30.7,12.6 | v31.1,24.8 R21.2 R20.1
  Bottom 0.254: v30.7,12.6 31.1,13 v31.1,24.8
N$20
  Top 0.254: R16.2 27.48,22.22 U1.18
N$21
  Top 0.254: X6.1 7.72,33.97 R29.2
N$22
  Top 0.406: U1.5 23.59,14.52 23.59,13.16 21.94,11.52 21.94,7.55 19.79,5.4 X3.1
N$23
  Top 0.406: U1.7 24.88,5.38 22.4,2.9 X3.2
N$24
  pour Top (rank 2, no thermals): 9.8,14.5 11.5,14.5 12.2,13.8 12.2,11.7 9.8,11.7
N$27
  pour Top (rank 2, no thermals): 24,13.9 24,12.9 22.4,11.3 22.4,10 24.5,10 24.5,14.4 24,14.4
N$28
  pour Top (no thermals): 25.9,14.4 25.9,10 28,10 28,11.3 26.4,12.9 26.4,14.4
RESET  (via drill 0.35)
  Top 0.254: Q1.3 SW2.B' | SW2.B' 5.66,54.75 C4.1 | SW2.B' 4.5,55.6 4.89,55.99 v5,55.99 R17.1 7.57,56.96 U4.3 | SW2.B v4.5,57.8
  Bottom 0.254: v4.5,57.8 5,57.3 v5,55.99
RTS  (via drill 0.35)
  Top 0.254: R13.2 7.41,49.3 v6.5,49.3 Q1.2 | v26.43,39.3 26.23,39.1 26.23,37.42 U5.19
  Bottom 0.254: v6.5,49.3 6.6,49.2 6.6,46.9 7.9,45.6 20.1,45.6 26.4,39.3 v26.43,39.3
RXD0
  Top 0.254: U4.34 27.1,54.42 27.2,54.52 26.5,54.52 25.3,53.32 25.3,37.45 U5.21
SCL
  Top 0.254: U4.36 29.97,56.96 R12.2 30.3,55.16 30.63,54.82 30.8,54.82 U3.5
SDA  (via drill 0.35)
  Top 0.254: U3.2 32.8,54.62 32.97,54.62 33.5,55.16 v33.5,56.2 33.5,57.09 R4.2 | U4.37 28.17,58.23 v28.5,57.9
  Bottom 0.254: v28.5,57.9 31.8,57.9 v33.5,56.2
SLEEP
  Top 0.254: U1.17 28.23,20.37 28.23,22.48 28.3,22.55 R11.2 28.35,22.65 28.9,23.2 28.9,27.7 29.54,28.34 29.54,45.96 27.43,48.07 U4.29
STEP
  Top 0.254: U1.22 24.88,22.47 24.48,22.87 24.48,25.27 28.29,29.09 28.29,39.84 25.8,42.34 25.8,44.8 26.53,45.53 U4.27
TXD0  (via drill 0.35)
  Top 0.254: U4.35 26.49,55.69 24.5,53.7 24.5,43.37 v24.54,43.34 | v26.01,40.7 25.77,40.46 25.77,37.42 U5.20
  Bottom 0.254: v24.54,43.34 24.54,43.27 26.01,41.8 v26.01,40.7
V_REG_OUT
  Top 0.254: R21.1 30.69,22.28 30.69,21.3 C13.2 30.26,21.1 U1.15
VBAT  (via drill 0.35)
  other vias: 21.3,12.1 29.4,12.2
  pour Top (no thermals): 0,11.7 0,15.2 1.8,17 11.3,17 11.3,14.9 10.8,14.9 10.2,14.3 9.6,14.3 6.8,11.5 0.2,11.5
  pour Top (no thermals): 23.1,14.6 23.1,13.3 21.5,11.7 21.5,7.6 20.4,6.5 19.6,6.5 19.6,12.5 19.8,12.7 22,12.7 22.8,13.5 22.8,14.6
  pour Top (no thermals): 27.3,14.5 27.3,13.2 29.1,11.4 29.1,7.7 29.2,7.6 31.1,7.6 31.1,11.4 29.7,12.8 28.5,12.8 27.7,13.6 27.7,14.5
  pour Bottom (no thermals): 0.7,13.9 28.7,13.9 31.1,11.5 0.7,11.5
VBUS  (via drill 0.35)
  Top 0.254: U5.8 24.23,33.38 24.23,33.02 25.81,31.45 v25.81,31.1 R7.2 25.81,28.7 C6.1 25.71,28.51 25,27.8 23.65,27.8 U2.1 | J2.VBUS 31.23,31.5 30.82,31.1 v30.3,31.1
  Bottom 0.254: v30.3,31.1 v25.81,31.1

### Text on the board
bPlace: Rayan Armani | Curtain Controller v2 / 25/01/2020